# Altium project DecentralizeLV.PrjPcb
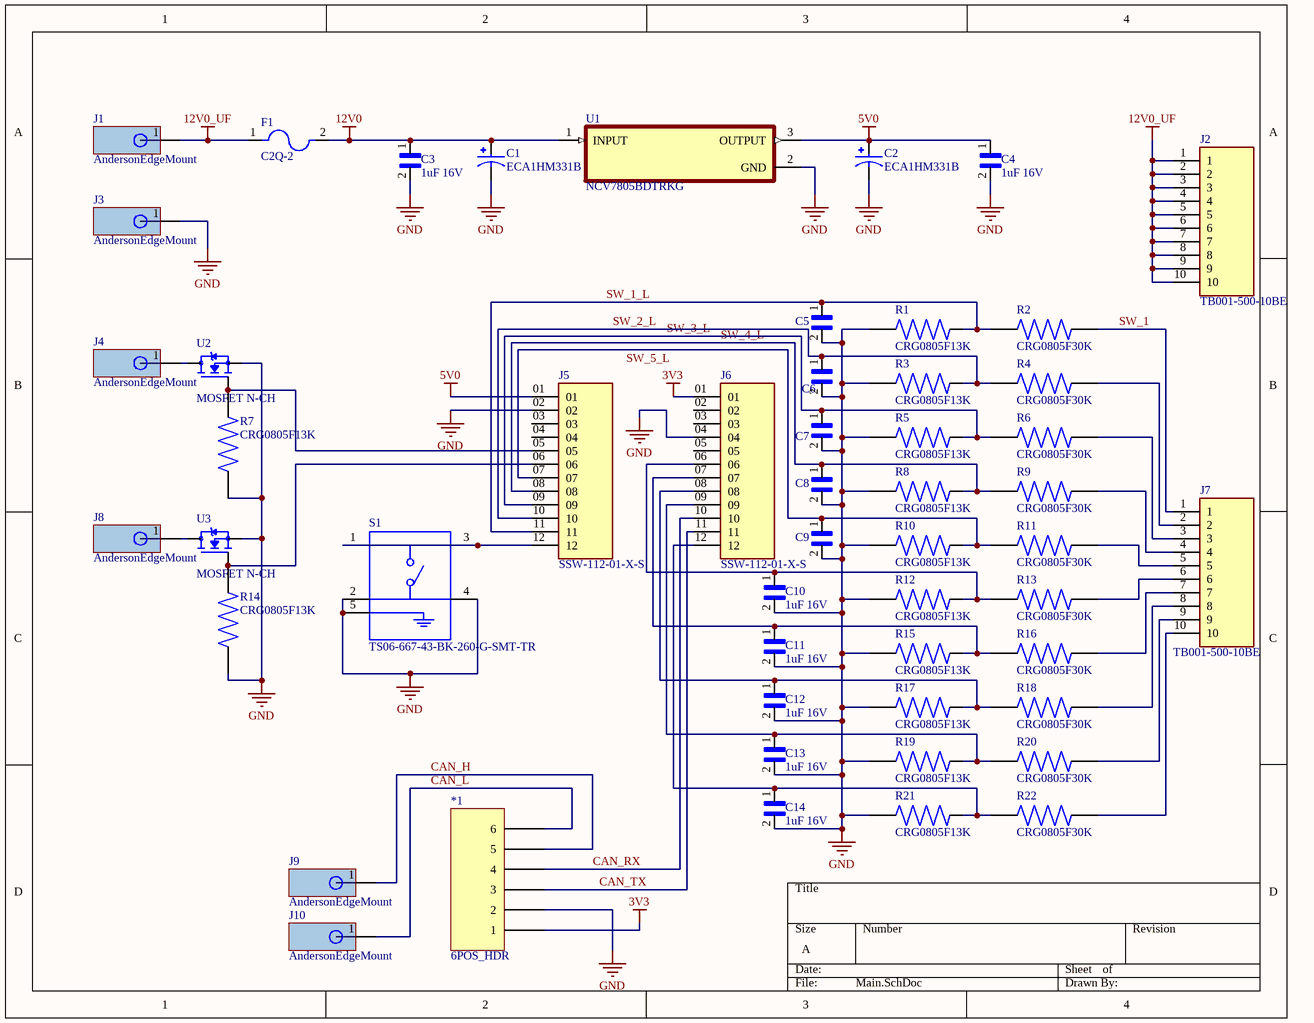
[diagram p0: Main.SchDoc]
1 sheet, 52 parts. Net scope: global (net labels, ports and power ports of the same name join across sheets).
Board file: MainPCB.PcbDoc

## Sheet Main.SchDoc
size A; SheetNumber: 1; SheetTotal: 1

### Parts
*1  6POS_HDR  [6POS_HDR]
C1  ECA1HM331B  [CAPPRD500W60D1000H1600]
C2  ECA1HM331B  [CAPPRD500W60D1000H1600]
C3  1uF 16V  [CAPC2012X135N]
C4  1uF 16V  [CAPC2012X135N]
C5  1uF 16V  [CAPC2012X135N]  (value not drawn)
C6  1uF 16V  [CAPC2012X135N]  (value not drawn)
C7  1uF 16V  [CAPC2012X135N]  (value not drawn)
C8  1uF 16V  [CAPC2012X135N]  (value not drawn)
C9  1uF 16V  [CAPC2012X135N]  (value not drawn)
C10  1uF 16V  [CAPC2012X135N]
C11  1uF 16V  [CAPC2012X135N]
C12  1uF 16V  [CAPC2012X135N]
C13  1uF 16V  [CAPC2012X135N]
C14  1uF 16V  [CAPC2012X135N]
F1  C2Q-2  [FUSC1608X56N]
J1  AndersonEdgeMount  [AndersonEdgeMount]
J2  TB001-500-10BE  [CUI_TB001-500-10BE]
J3  AndersonEdgeMount  [AndersonEdgeMount]
J4  AndersonEdgeMount  [AndersonEdgeMount]
J5  SSW-112-01-X-S  [SAMTEC_SSW-112-01-X-S]
J6  SSW-112-01-X-S  [SAMTEC_SSW-112-01-X-S]
J7  TB001-500-10BE  [CUI_TB001-500-10BE]
J8  AndersonEdgeMount  [AndersonEdgeMount]
J9  AndersonEdgeMount  [AndersonEdgeMount]
J10  AndersonEdgeMount  [AndersonEdgeMount]
R1  CRG0805F13K  [RESC2012X65N]
R2  CRG0805F30K  [RESC2012X65N]
R3  CRG0805F13K  [RESC2012X65N]
R4  CRG0805F30K  [RESC2012X65N]
R5  CRG0805F13K  [RESC2012X65N]
R6  CRG0805F30K  [RESC2012X65N]
R7  CRG0805F13K  [RESC2012X65N]
R8  CRG0805F13K  [RESC2012X65N]
R9  CRG0805F30K  [RESC2012X65N]
R10  CRG0805F13K  [RESC2012X65N]
R11  CRG0805F30K  [RESC2012X65N]
R12  CRG0805F13K  [RESC2012X65N]
R13  CRG0805F30K  [RESC2012X65N]
R14  CRG0805F13K  [RESC2012X65N]
R15  CRG0805F13K  [RESC2012X65N]
R16  CRG0805F30K  [RESC2012X65N]
R17  CRG0805F13K  [RESC2012X65N]
R18  CRG0805F30K  [RESC2012X65N]
R19  CRG0805F13K  [RESC2012X65N]
R20  CRG0805F30K  [RESC2012X65N]
R21  CRG0805F13K  [RESC2012X65N]
R22  CRG0805F30K  [RESC2012X65N]
S1  TS06-667-43-BK-260-G-SMT-TR  [SW_TS06-667-43-BK-260-G-SMT-TR]
U1  NCV7805BDTRKG  [DPAK229P990X238-4N]
U2  MOSFET N-CH  [ZXMN6A09GTA]
U3  MOSFET N-CH  [ZXMN6A09GTA]

### Nets
3V3: *1.1 J6.01
5V0: C2.P C4.1 J5.01 U1.3(OUTPUT)
12V0: C1.P C3.1 F1.2 U1.1(INPUT)
12V0_UF: F1.1 J1.1 J2.1 J2.2 J2.3 J2.4 J2.5 J2.6 J2.7 J2.8 J2.9 J2.10
GND: *1.2 C1.N C2.N C3.2 C4.2 C5.2 C6.2 C7.2 C8.2 C9.2 C10.2 C11.2 C12.2 C13.2 C14.2 J3.1 J5.02 J6.04 R1.2 R3.2 R5.2 R7.1 R8.2 R10.2 R12.2 R14.1 R15.2 R17.2 R19.2 R21.2 S1.2 S1.4 S1.5 U1.2(GND) U2.3 U3.3
CAN_H: *1.5 J9.1
CAN_L: *1.6 J10.1
CAN_RX: *1.4 J6.10
CAN_TX: *1.3 J6.11
SW_1: J7.1 R2.2
SW_1_L: C5.1 J5.11 R1.1 R2.1
SW_2_L: C6.1 J5.10 R3.1 R4.1
SW_3_L: C7.1 J5.09 R5.1 R6.1
SW_4_L: C8.1 J5.08 R8.1 R9.1
SW_5_L: C9.1 J5.07 R10.1 R11.1
NetC10_1: C10.1 J6.06 R12.1 R13.1
NetC11_1: C11.1 J6.07 R15.1 R16.1
NetC12_1: C12.1 J6.08 R17.1 R18.1
NetC13_1: C13.1 J6.09 R19.1 R20.1
NetC14_1: C14.1 J6.12 R21.1 R22.1
NetJ4_1: J4.1 U2.2
NetJ5_05: J5.05 R7.2 U2.1
NetJ5_06: J5.06 R14.2 U3.1
NetJ5_12: J5.12 S1.1 S1.3
NetJ7_2: J7.2 R4.2
NetJ7_3: J7.3 R6.2
NetJ7_4: J7.4 R9.2
NetJ7_5: J7.5 R11.2
NetJ7_6: J7.6 R13.2
NetJ7_7: J7.7 R16.2
NetJ7_8: J7.8 R18.2
NetJ7_9: J7.9 R20.2
NetJ7_10: J7.10 R22.2
NetJ8_1: J8.1 U3.2

Not connected (* = marked no-connect by the designer): J5 03 04; J6 02 03 05

### Library data of the parts
C1 C2 = ECA1HM331B: M-A; MF: {'manufacturer': u'Panasonic Electronic'}; MP: ECA1HM331B; Price: None; Package: None; Value: *; Availability: Unavailable
C3-C14 = CL21B105KOFNNNE: Cap Ceramic 1uF 16V X7R 10% Pad SMD 0805 125C T/R; MF: {'manufacturer': u'Samsung Electro-Mechanics'}; Price: None; MP: CL21B105KOFNNNE; Availability: Unavailable; Value: *; Package: None
F1 = C2Q-2: MF: {'manufacturer': u'Bel Fuse'}; Package: None; Availability: Unavailable; Value: *; MP: C2Q-2; Price: None
J1 J3 J4 J8-J10 = AndersonEdgeMount: Edge Mounted Anderson Connector
J2 J7 = TB001-500-10BE: MF: {'manufacturer': u'CUI Devices'}; MP: TB001-500-10BE; Price: None; Package: None; Value: *; Availability: Unavailable
J5 J6 = SSW-112-01-X-S: CONN RCPT 12POS 0.1 GOLD PCB; MF: {'manufacturer': u'Samtec'}; Package: None; Availability: Unavailable; Value: *; MP: SSW-112-01-X-S; Price: None
R1 R3 R5 R7 R8 R10 R12 R14 R15 R17 R19 R21 = CRG0805F13K: CRG0805 1% 13K; MF: {'manufacturer': u'TE Connectivity'}; MP: CRG0805F13K; Price: None; Package: None; Value: *; Availability: Unavailable
R2 R4 R6 R9 R11 R13 R16 R18 R20 R22 = CRG0805F30K: CRG0805 1% 30K; MF: {'manufacturer': u'TE Connectivity'}; MP: CRG0805F30K; Price: None; Package: None; Value: *; Availability: Unavailable
S1 = TS06-667-43-BK-260-G-SMT-TR: MF: {'manufacturer': u'CUI Devices'}; MP: TS06-667-43-BK-260-G-SMT-TR; Price: None; Package: None; Value: *; Availability: Unavailable
U1 = NCV7805BDTRKG: MF: {'manufacturer': u'ON Semiconductor'}; MP: NCV7805BDTRKG; Price: None; Package: None; Value: *; Availability: Unavailable
U2 U3 = ZXMN6A09GTA